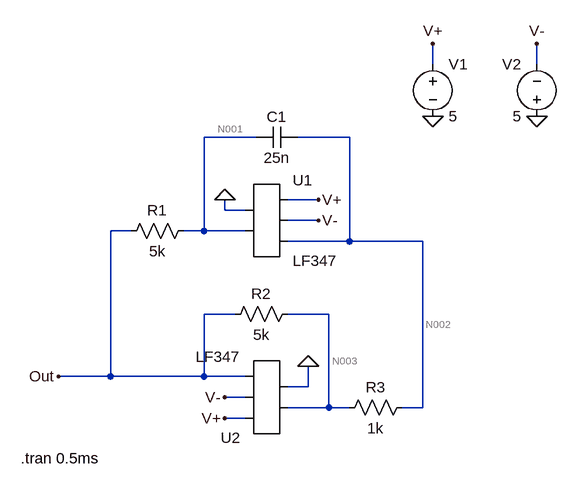
[diagram p0: schematic q1.asc]
* q1.asc
* U1: LF347 (symbol AutoGenerated\LF347 not available, pins judged from their places): pin1=0 pin2=N001 pin3=V+ pin4=V- pin5=N002
V1 V+ 0 5
V2 0 V- 5
* U2: LF347 (symbol AutoGenerated\LF347 not available, pins judged from their places): pin1=N003 pin2=0 pin3=V+ pin4=V- pin5=Out
R1 N001 Out 5k
R3 N002 N003 1k
R2 N003 Out 5k
C1 N002 N001 25n
.tran 0.5ms
.backanno
.end

* Results of the author's LTspice run, read from the files saved beside the schematic
* Operating Point, zero values left out:
*   V(n002) = -2.611 µV
*   V(v-) = -5 V
*   V(v+) = 5 V
*   V(n001) = 1.865 µV
*   V(out) = 2.14 µV
*   V(n003) = -1.865 µV
*   I(R2) = -800.9 pA
*   I(R3) = -745.9 pA
*   I(R1) = -55.01 pA
*   I(V2) = -1.724 mA
*   I(V1) = -1.723 mA
*   Ix(u1:1) = 55.01 pA
*   Ix(u1:2) = 55.01 pA
*   Ix(u1:3) = 861.7 µA
*   Ix(u1:4) = -862 µA
*   Ix(u1:5) = 745.9 pA
*   Ix(u2:1) = 55.01 pA
*   Ix(u2:2) = 55.01 pA
*   Ix(u2:3) = 861.7 µA
*   Ix(u2:4) = -862 µA
*   Ix(u2:5) = -855.9 pA
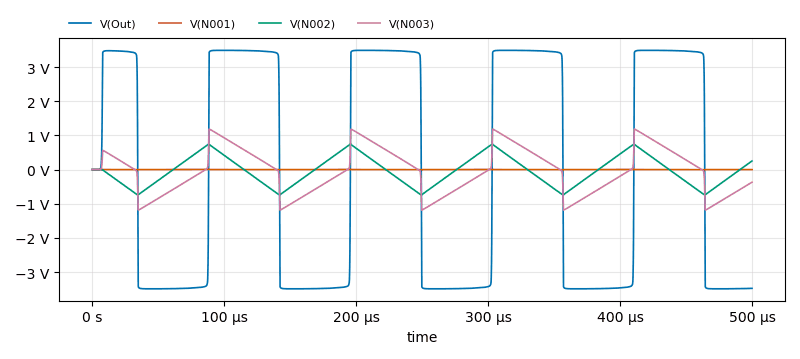
[diagram p1: Transient Analysis of q1.asc, plotted from the saved traces]
* Transient Analysis, 1 run:
*   V(Out): min -3.487 V, max 3.487 V, average -63.41 mV, rms 3.425 V, last -3.474 V
*   V(N001): min -12.57 mV, max 12.52 mV, average -29.19 µV, rms 1.667 mV, last -1.387 mV
*   V(N002): min -750 mV, max 749.7 mV, average -37.86 mV, rms 436.5 mV, last 252 mV
*   V(N003): min -1.182 V, max 1.182 V, average -42.12 mV, rms 676.5 mV, last -369 mV